# EAGLE design Base_Board (EAGLE 9.4.2)

## Sheet 1 of 3
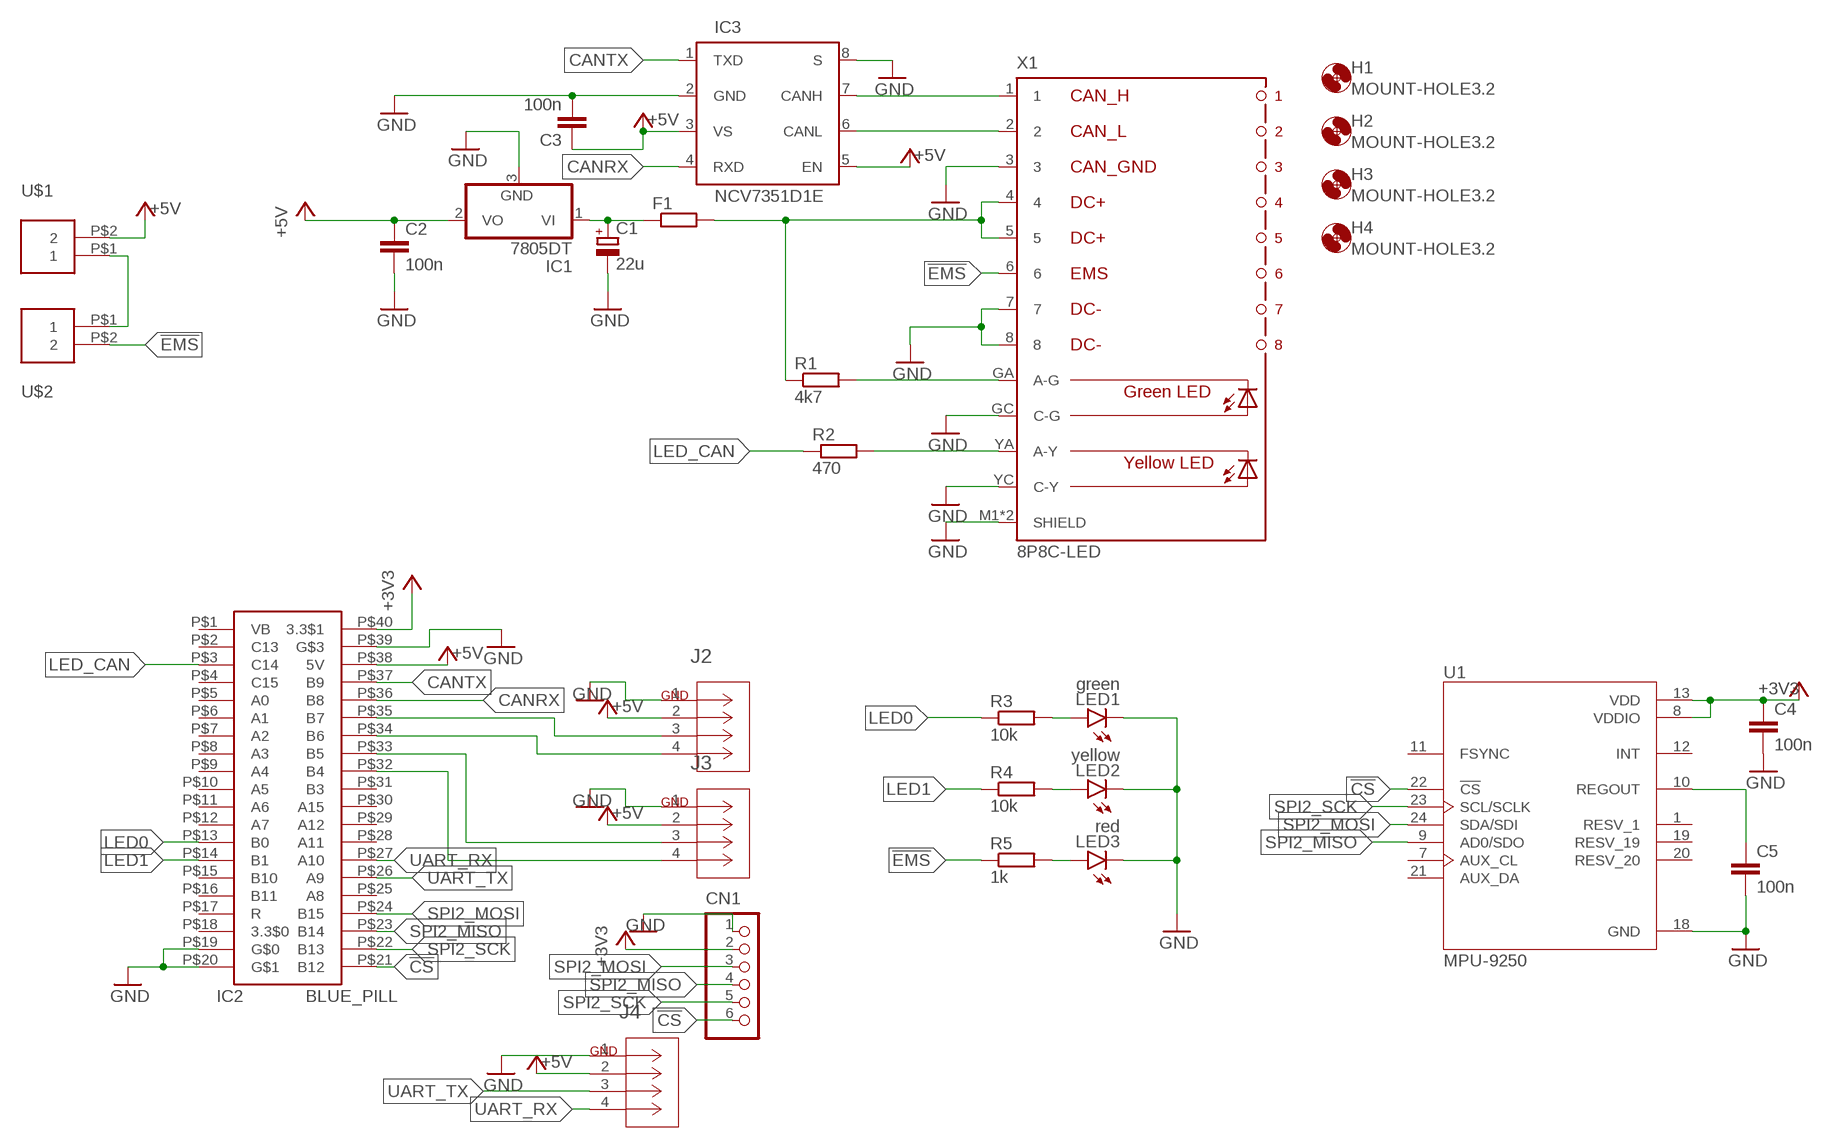
[diagram p0: schematic, sheet 1]

### Parts
C1  22u  CPOL-EUE2.5-5  [E2,5-5]
C2  100n  C-EUC0603  [C0603]
C3  100n  C-EUC0603  [C0603]
C4  100n  C-EUC0603  [C0603]
C5  100n  C-EUC0603  [C0603]
CN1  S6B-XH-A  [S6B-XH-A]
F1  R-EU_R1206  [R1206]
H1  MOUNT-HOLE3.2  [3,2]
H2  MOUNT-HOLE3.2  [3,2]
H3  MOUNT-HOLE3.2  [3,2]
H4  MOUNT-HOLE3.2  [3,2]
IC1  7805DT  [TO252]
IC2  BLUE_PILL  [BLUE_PILL]
IC3  NCV7351D1E  [SO08]
J2  EP2.5-4-SIDE  [CONN4_1744426-4]
J3  EP2.5-4-SIDE  [CONN4_1744426-4]
J4  EP2.5-4-SIDE  [CONN4_1744426-4]
LED1  green  LEDCHIPLED_0805  [CHIPLED_0805]
LED2  yellow  LEDCHIPLED_0805  [CHIPLED_0805]
LED3  red  LEDCHIPLED_0805  [CHIPLED_0805]
R1  4k7  R-EU_R0603  [R0603]
R2  470  R-EU_R0603  [R0603]
R3  10k  R-EU_R0603  [R0603]
R4  10k  R-EU_R0603  [R0603]
R5  1k  R-EU_R0603  [R0603]
U1  MPU-9250  [QFN40P300X300X105-24N]
U$1  XH-2-STRAIGHT  [CON-XH-2-STRAIGHT]
U$2  XH-2-STRAIGHT  [CON-XH-2-STRAIGHT]
X1  8P8C-LED  [8P8C-LED]

### Nets
!CS: CN1.6 IC2.P$21(B12) U1.22(!CS)
!EMS: R5.1 U$2.P$2 X1.6
+3V3: C4.1 CN1.2 IC2.P$40(3.3$1) U1.8(VDDIO) U1.13(VDD)
+5V: C2.1 C3.1 IC1.2(VO) IC2.P$38(5V) IC3.3(VS) IC3.5(EN) J2.2 J3.2 J4.2 U$1.P$2
CANRX: IC2.P$36(B8) IC3.4(RXD)
CANTX: IC2.P$37(B9) IC3.1(TXD)
GND: C1.- C2.2 C3.2 C4.2 C5.2 CN1.1 IC1.3(GND) IC2.P$19(G$0) IC2.P$20(G$1) IC2.P$39(G$3) IC3.2(GND) IC3.8(S) J2.1 J3.1 J4.1 LED1.C LED2.C LED3.C U1.18(GND) X1.3 X1.7 X1.8 X1.GC(C-G) X1.M1(SHIELD) X1.M2(SHIELD) X1.YC(C-Y)
LED0: IC2.P$13(B0) R3.1
LED1: IC2.P$14(B1) R4.1
LED_CAN: IC2.P$3(C14) R2.1
N$1: R1.2 X1.GA(A-G)
N$2: F1.2 R1.1 X1.4 X1.5
N$3: C1.+ F1.1 IC1.1(VI)
N$4: IC3.7(CANH) X1.1
N$5: IC3.6(CANL) X1.2
N$6: IC2.P$32(B4) J3.4
N$7: IC2.P$33(B5) J3.3
N$8: IC2.P$34(B6) J2.4
N$9: R2.2 X1.YA(A-Y)
N$10: IC2.P$35(B7) J2.3
N$11: U$1.P$1 U$2.P$1
N$13: LED1.A R3.2
N$14: LED2.A R4.2
N$15: LED3.A R5.2
N$20: C5.1 U1.10(REGOUT)
SPI2_MISO: CN1.4 IC2.P$23(B14) U1.9(AD0/SDO)
SPI2_MOSI: CN1.3 IC2.P$24(B15) U1.24(SDA/SDI)
SPI2_SCK: CN1.5 IC2.P$22(B13) U1.23(SCL/SCLK)
UART_RX: IC2.P$27(A10) J4.4
UART_TX: IC2.P$26(A9) J4.3
Unconnected: IC2.P$1(VB) IC2.P$2(C13) IC2.P$4(C15) IC2.P$5(A0) IC2.P$6(A1) IC2.P$7(A2) IC2.P$8(A3) IC2.P$9(A4) IC2.P$10(A5) IC2.P$11(A6) IC2.P$12(A7) IC2.P$15(B10) IC2.P$16(B11) IC2.P$17(R) IC2.P$18(3.3$0) IC2.P$25(A8) IC2.P$28(A11) IC2.P$29(A12) IC2.P$30(A15) IC2.P$31(B3) U1.1(RESV_1) U1.7(AUX_CL) U1.11(FSYNC) U1.12(INT) U1.19(RESV_19) U1.20(RESV_20) U1.21(AUX_DA)

## Sheet 2 of 3

## Sheet 3 of 3

## Library data of the parts
C1 = rcl:CPOL-EU: POLARIZED CAPACITOR, European symbol; SPICEPREFIX: C
C2-C5 = rcl:C-EU: CAPACITOR, European symbol; SPICEPREFIX: C
CN1 = jst-xh:S6B-XH-A: Wire-to-Board 2.5mm pitch side mount connector Source: http://www.jst-mfg.com/product/pdf/jpn/XH.pdf http://www.jst-mfg.com/product/detail.php?series=277
F1 R1-R5 = rcl:R-EU_: RESISTOR, European symbol; SPICEPREFIX: R
H1-H4 = holes:MOUNT-HOLE: MOUNTING HOLE with drill center marker
IC1 = linear:78*: Positive VOLTAGE REGULATOR Source: http://cache.national.com/ds/LM/LM78L05.pdf http://www.fairchildsemi.com/ds/LM/LM7805.pdf
IC2 = stm32_mcu:BLUE_PILL
IC3 = on-semi:NCV7351D1E: High Speed CAN Transceiver Source: NCV7351-D.PDF <http://www.onsemi.com/PowerSolutions/document/NCV7351-D.PDF>
J2-J4 = con-ep2.5:EP2.5-4-SIDE; MANUFACTURER_PART_NUMBER: 17444264; VENDOR: TE Connectivity
LED1-LED3 = led:LED: LED OSRAM: - CHIPLED LG R971, LG N971, LY N971, LG Q971, LY Q971, LO R971, LY R971 LH N974, LH R974 LS Q976, LO Q976, LY Q976 LO Q996 - Hyper CHIPLED LW Q18S LB Q993, LB Q99A, LB R99A - SideLED LS A670, LO A670, LY A670, LG A670, LP A670 LB A673, LV A673, LT A673, LW A673 LH A674 LY A675 LS A676, LA A676, LO A676, LY A676, LW A676 LS A679, LY A679, LG A679 - Hyper Micro SIDELED® LS Y876, LA Y876, LO Y876, LY Y876 LT Y87S - SmartLED LW L88C, LW L88S LB L89C, LB L89S, LG L890 LS L89K, LO L89K, LY L89K LS L896, LA L896, LO L896, LY L896 - TOPLED LS T670, LO T670, LY T670, LG T670, LP T670 LSG T670, LSP T670, LSY T670, LOP T670, LYG T670 LG T671, LOG T671, LSG T671 LB T673, LV T673, LT T673, LW T673 LH T674 LS T676, LA T676, LO T676, LY T676, LB T676, LH T676, LSB T676, LW T676 LB T67C, LV T67C, LT T67C, LS T67K, LO T67K, LY T67K, LW E67C LS E67B, LA E67B, LO E67B, LY E67B, LB E67C, LV E67C, LT E67C LW T67C LS T679, LY T679, LG T679 LS T770, LO T770, LY T770, LG T770, LP T770 LB T773, LV T773, LT T773, LW T773 LH T774 LS E675, LA E675, LY E675, LS T675 LS T776, LA T776, LO T776, LY T776, LB T776 LHGB T686 LT T68C, LB T68C - Hyper Mini TOPLED® LB M676 - Mini TOPLED Santana® LG M470 LS M47K, LO M47K, LY M47K Source: http://www.osram.convergy.de LUXEON: - LUMILED® LXK2-PW12-R00, LXK2-PW12-S00, LXK2-PW14-U00, LXK2-PW14-V00 LXK2-PM12-R00, LXK2-PM12-S00, LXK2-PM14-U00 LXK2-PE12-Q00, LXK2-PE12-R00, LXK2-PE12-S00, LXK2-PE14-T00, LXK2-PE14-U00 LXK2-PB12-K00, LXK2-PB12-L00, LXK2-PB12-M00, LXK2-PB14-N00, LXK2-PB14-P00, LXK2-PB14-Q00 LXK2-PR12-L00, LXK2-PR12-M00, LXK2-PR14-Q00, LXK2-PR14-R00 LXK2-PD12-Q00, LXK2-PD12-R00, LXK2-PD12-S00 LXK2-PH12-R00, LXK2-PH12-S00 LXK2-PL12-P00, LXK2-PL12-Q00, LXK2-PL12-R00 Source: www.luxeon.com KINGBRIGHT: KA-3528ASYC Source: www.kingbright.com
U1 = MPU-9250:MPU-9250: Axis=3 Axis Gyro+3 Axis Accel+Compass. Pin For Pin With m; AVAILABILITY: Unavailable; DESCRIPTION: SMD Gyroscope/Accelerometer/Magnetometer Sensor; 9-AXIS; MF: TDK InvenSense; MP: MPU-9250; PACKAGE: QFN-24 TDK InvenSense; PRICE: None
U$1 U$2 = con-xh:XH-2-STRAIGHT
X1 = con-rj45:8P8C-LED: generic 8P8C connector with two LED's; OC_FARNELL: unknown; OC_NEWARK: unknown

## Board
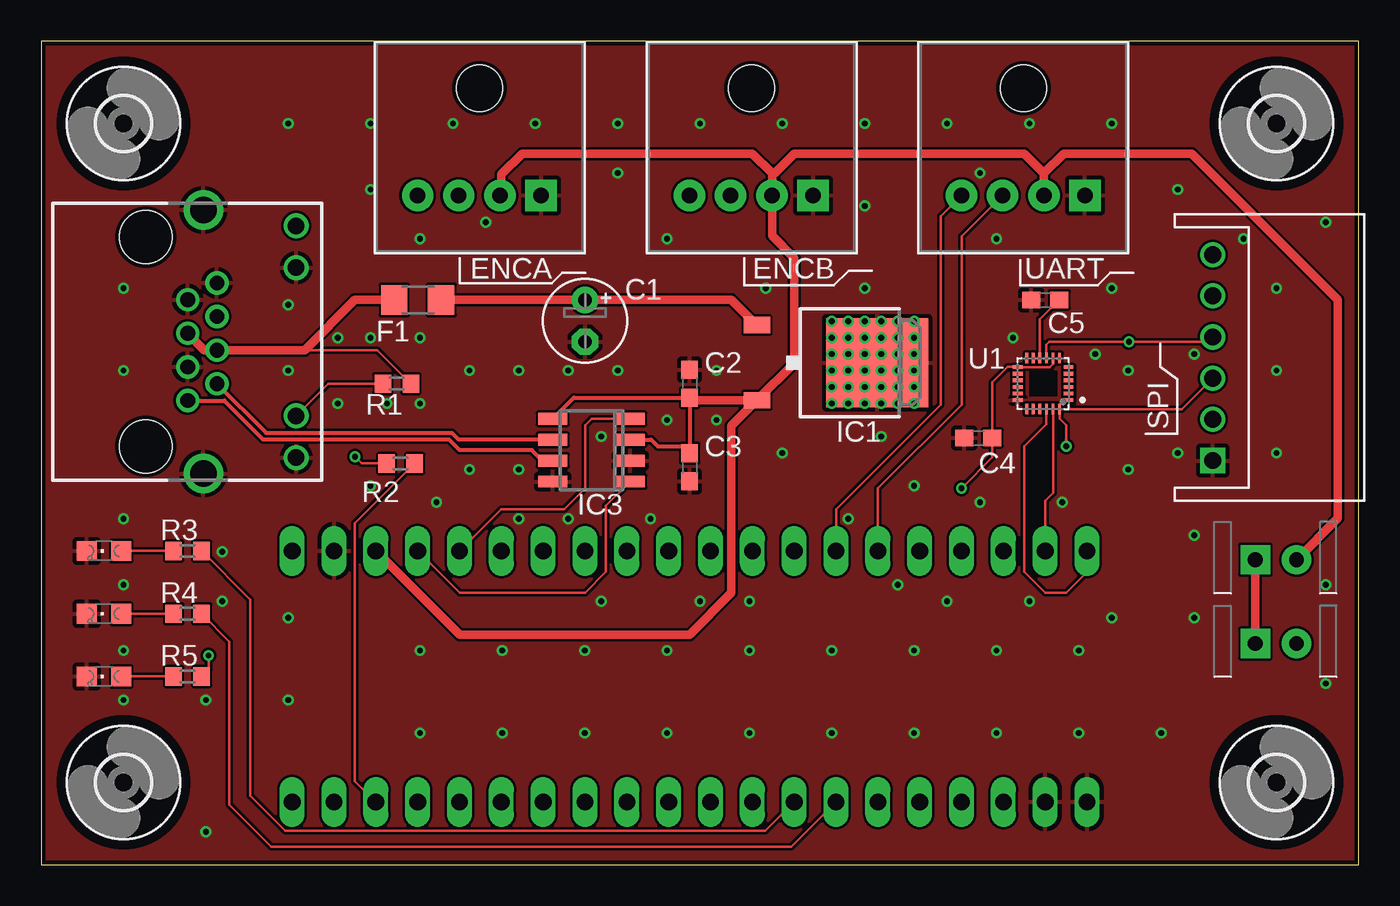
[diagram p1: board, top side]
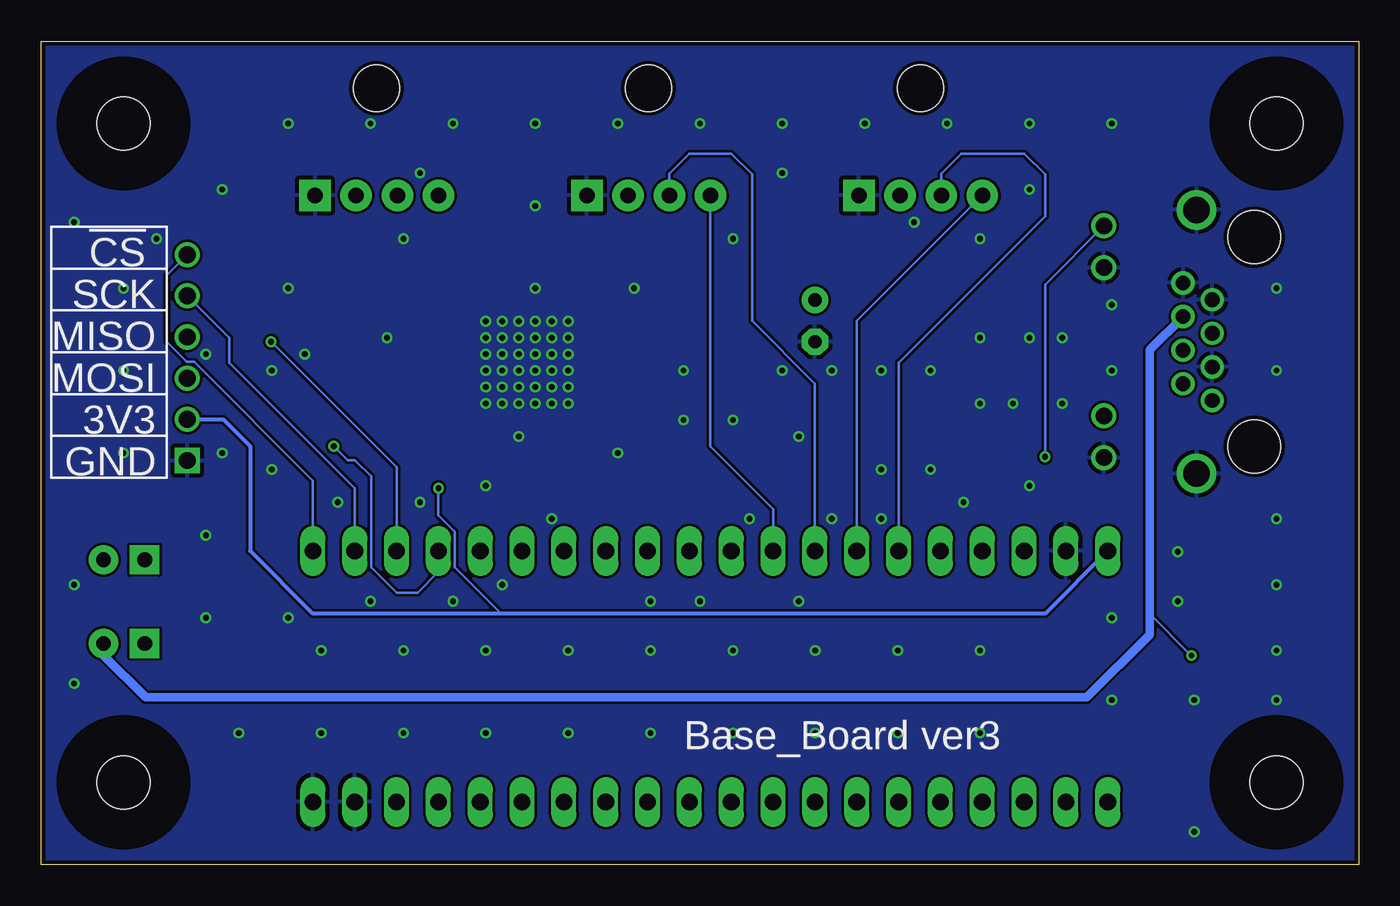
[diagram p2: board, bottom side, seen from below]

Size 80 x 50 mm. Coordinates in mm from the lower left corner, seen from the top.
Outline: 0,0 80,0 80,50 0,50 0,0
Copper layers (1*16): Top 0.035mm / dielectric 1.5mm / Bottom 0.035mm
Design rules "SeeedStudio_2layer_DRU_no_angle_20140221 *": minimum track width 6mil, minimum drill 12mil, track to track 6mil, track to pad 6mil, pad to pad 6mil, via to via 6mil, smd to smd 0mil, copper to edge 10mil, drill to drill 10mil, minimum pad ring 10mil, minimum via ring 6mil, stop-mask expansion 2mil, vias tented up to drill 100mil, thermal gap 10mil

### Footprints (pad centres in the part's own frame; a part is rotated, then mirrored left to right if it is on the bottom)
E2,5-5 = drill 0.813 pad 1.6: + -1.27,0 | drill 0.813 pad 1.6 octagon: - 1.27,0
C0603 = smd 1.1 x 1: 1 -0.85,0; 2 0.85,0
S6B-XH-A = drill 1.016 square: 1 6.25,0 | drill 1.016: 2 3.75,0; 3 1.25,0; 4 -1.25,0; 5 -3.75,0; 6 -6.25,0
R1206 = smd 1.6 x 1.803: 1 -1.422,0; 2 1.422,0
3,2 = hole 3.2: 0,0
TO252 = smd 1 x 1.6: 1 -2.28,-4.8; 2 2.28,-4.8 | smd 5.4 x 6.2: 3 0,2.5
BLUE_PILL = drill 1.016 long: P$1 -7.62,10.16; P$2 -7.62,7.62; P$3 -7.62,5.08; P$4 -7.62,2.54; P$5 -7.62,0; P$6 -7.62,-2.54; P$7 -7.62,-5.08; P$8 -7.62,-7.62; P$9 -7.62,-10.16; P$10 -7.62,-12.7; P$11 -7.62,-15.24; P$12 -7.62,-17.78; P$13 -7.62,-20.32; P$14 -7.62,-22.86; P$15 -7.62,-25.4; P$16 -7.62,-27.94; P$17 -7.62,-30.48; P$18 -7.62,-33.02; P$19 -7.62,-35.56; P$20 -7.62,-38.1; P$21 7.62,-38.1; P$22 7.62,-35.56; P$23 7.62,-33.02; P$24 7.62,-30.48; P$25 7.62,-27.94; P$26 7.62,-25.4; P$27 7.62,-22.86; P$28 7.62,-20.32; P$29 7.62,-17.78; P$30 7.62,-15.24; P$31 7.62,-12.7; P$32 7.62,-10.16; P$33 7.62,-7.62; P$34 7.62,-5.08; P$35 7.62,-2.54; P$36 7.62,0; P$37 7.62,2.54; P$38 7.62,5.08; P$39 7.62,7.62; P$40 7.62,10.16
SO08 = smd 0.72 x 1.78: 1 -1.905,-2.35; 2 -0.635,-2.35; 3 0.635,-2.35; 4 1.905,-2.35; 5 1.905,2.35; 6 0.635,2.35; 7 -0.635,2.35; 8 -1.905,2.35
CONN4_1744426-4 = drill 0.94 pad 1.905 square: 1 7.493,0 | drill 0.94 pad 1.905: 2 5.004,0; 3 2.489,0; 4 0,0 | hole 2.794: 3.759,6.502
CHIPLED_0805 = smd 1.2 x 1.2: A 0,-1.05; C 0,1.05
R0603 = smd 1 x 1.1: 1 -0.85,0; 2 0.85,0
QFN40P300X300X105-24N = smd 0.64 x 0.22: 1 -1.545,1; 2 -1.545,0.6; 3 -1.545,0.2; 4 -1.545,-0.2; 5 -1.545,-0.6; 6 -1.545,-1; 13 1.545,-1; 14 1.545,-0.6; 15 1.545,-0.2; 16 1.545,0.2; 17 1.545,0.6; 18 1.545,1 | smd 0.22 x 0.64: 7 -1,-1.545; 8 -0.6,-1.545; 9 -0.2,-1.545; 10 0.2,-1.545; 11 0.6,-1.545; 12 1,-1.545; 19 1,1.545; 20 0.6,1.545; 21 0.2,1.545; 22 -0.2,1.545; 23 -0.6,1.545; 24 -1,1.545
CON-XH-2-STRAIGHT = drill 0.9 pad 1.778 square: P$1 1.21,-0.73 | drill 0.9 pad 1.778: P$2 -1.29,-0.73
8P8C-LED = drill 0.9 pad 1.3: 1 3.57,-3.81; 2 2.55,-2.03; 3 1.53,-3.81; 4 0.51,-2.03; 5 -0.51,-3.81; 6 -1.53,-2.03; 7 -2.55,-3.81; 8 -3.57,-2.03 | drill 1 pad 1.422: GA 4.5,2.78; GC 7.04,2.78; YA -7.04,2.78; YC -4.5,2.78 | drill 1.6 pad 2.184: M1 -8,-2.85; M2 8,-2.85 | hole 3.2: 6.35,-6.35; -6.35,-6.35

### Placement (x,y rotation side)
C1  33.02,33.02 270 top
C2  39.37,29.21 90 top
C3  39.37,24.13 270 top
C4  56.9,25.91 180 top
C5  60.96,34.29 180 top
CN1  71.13,30.79 270 top
F1  22.86,34.29 180 top
H1  5,5 0 top
H2  5,45 0 top
H3  75,45 0 top
H4  75,5 0 top
IC1  48.26,30.48 270 top
IC2  25.4,11.43 90 top
IC3  33.41,25.17 90 top
J2  22.86,40.64 0 top
J3  39.37,40.64 0 top
J4  55.88,40.64 0 top
LED1  3.81,19.05 90 top
LED2  3.81,15.24 90 top
LED3  3.81,11.43 90 top
R1  21.59,29.21 180 top
R2  21.82,24.36 180 top
R3  8.89,19.05 180 top
R4  8.89,15.24 180 top
R5  8.89,11.43 180 top
U1  60.83,29.21 180 top
U$1  74.93,17.78 180 top
U$2  74.93,12.7 180 top
X1  12.7,31.75 270 top

### Tracks (layer width: path | path; a pad name or v marks a point on that pad's centre or on a via)
!CS
  Top 0.152: IC2.P$21 63.5,17.78 62.23,16.51 60.96,16.51 59.69,17.78 59.69,25.4 61.03,26.74 U1.22
  Bottom 0.152: CN1.6 72.39,35.78 72.39,31.75 71.17,30.53 70.72,30.53 63.5,23.31 IC2.P$21
!EMS  (via drill 0.35)
  Top 0.152: v10.16,12.7 10.16,11.85 R5.1
  Bottom 0.152: v10.16,12.7 12.7,15.24
  Bottom 0.508: X1.6 12.7,31.25 12.7,15.24 12.7,13.97 16.51,10.16 73.66,10.16 76.22,12.72 U$2.P$2
+3V3  (via drill 0.35)
  Top 0.152: U1.8 61.43,30.42 61.22,30.21 59.64,30.21 U1.13 59.27,30.23 58.67,30.23 57.75,29.3 C4.1 57.75,24.73 v55.88,22.86
  Bottom 0.152: 52.07,15.24 54.89,18.06 54.89,20.22 55.88,21.21 v55.88,22.86
  Bottom 0.254: IC2.P$40 19.05,15.24 52.07,15.24 63.5,15.24 67.31,19.05 67.31,25.4 68.95,27.04 CN1.2
+5V
  Top 0.254: IC3.5 32.34,28.36 C2.1 C3.1 38.95,25.4 37.44,25.4 37.03,25.8 IC3.3
  Top 0.508: IC1.2 39.53,28.2 C2.1 | IC1.2 45.72,30.46 45.72,36.83 44.37,38.18 J3.2 44.37,41.99 | J2.2 27.94,40.72 27.94,41.91 29.21,43.18 43.18,43.18 44.37,41.99 | J4.2 60.88,41.99 | 60.88,41.99 59.69,43.18 45.72,43.18 44.53,41.99 44.37,41.99 | 60.88,41.99 62.08,43.18 69.85,43.18 78.73,34.3 78.73,21.02 U$1.P$2 | IC2.P$38 25.4,13.97 39.37,13.97 41.91,16.51 41.91,26.65 IC1.2
CANRX
  Top 0.152: IC2.P$36 27.94,21.59 31.75,21.59 33.02,22.86 33.02,26.67 33.42,27.07 IC3.4
CANTX
  Top 0.152: IC2.P$37 25.4,16.51 33.02,16.51 34.29,17.78 34.29,21.8 IC3.1
GND  (via drill 0.35)
  other vias: 15,10 10,10 5,10 15,15 15,30 5,30 5,35 65,15 70,15 70,20 65,35 50,35 50,40 50,45 55,45 60,45 65,45 45,45 40,45 35,45 30,45 25,45 20,45 15,45 45,25 63,13 58,13 53,13 48,13 43,13 38,13 33,13 28,13 23,13 60,16 55,16 62,22 66,24 57,22 53,23 49,21 43,16 40,16 41,30 35,30 32,30 29,30 29,24 23,38 18,28 21,28 18,32 20,32 20,23 29,21 32,21 34,16 37,21 38,27 41,27 11,16 11,19 20,41 27,39 38,38 44,35 58,38 59,32 66,30 64,31 69,25 78,39 10,2 15,34 23,32 23,28 26,30 24,22 26,24 51,26 52,17 70,31 73,38 69,41 57,42 35,42 34,26 23,8 28,8 33,8 38,8 43,8 48,8 53,8 58,8 63,8 75,25 75,30 75,35 78,17 78,11 68,8 5,13 5,17 5,21 48,33 49,33 50,33 51,33 52,33 53,33 48,32 48,31 48,30 48,29 48,28 49,28 49,29 49,30 49,31 49,32 50,32 50,31 50,30 50,29 50,28 51,28 51,29 51,30 51,31 51,32 52,32 52,31 52,30 52,29 52,28 53,28 53,29 53,30 53,31 53,32
  pour Top: 0,50 0,0 80,0 80,50
  pour Bottom: 0,50 0,0 80,0 80,50
LED0
  Top 0.152: IC2.P$13 43.97,2.06 15.24,2.06 14.83,2.06 12.7,4.19 12.7,16.09 R3.1
LED1
  Top 0.152: IC2.P$14 45.54,1.09 13.97,1.09 11.43,3.63 11.43,13.55 R4.1
LED_CAN
  Top 0.152: R2.1 19.05,20.74 19.05,5.08 IC2.P$3
N$1
  Top 0.152: R1.2 17.44,29.21 X1.GA
N$2
  Top 0.152: R1.1 20.41,31.24 16,31.24
  Top 0.508: X1.5 9.91,31.24 X1.4 16,31.24 19.05,34.29 F1.2
N$3
  Top 0.508: F1.1 C1.+ 41.91,34.29 43.44,32.76 IC1.1
N$4
  Top 0.254: X1.1 11.12,28.18 13.48,25.81 24.77,25.81 25.41,25.17 29.79,25.17 30.43,24.54 IC3.7
N$5
  Top 0.254: X1.2 13.65,26.22 24.93,26.22 25.34,25.8 IC3.6
N$6
  Bottom 0.152: J3.4 39.37,25.4 35.56,21.59 IC2.P$32
N$7
  Bottom 0.152: IC2.P$33 33.02,29.21 36.83,33.02 36.83,41.91 38.1,43.18 40.64,43.18 41.86,41.96 J3.3
N$8
  Bottom 0.152: J2.4 30.48,33.02 IC2.P$34
N$9  (via drill 0.35)
  Top 0.152: R2.2 19.45,24.36 v19.05,24.77
  Bottom 0.152: X1.YA 19.05,35.22 v19.05,24.77
N$10
  Bottom 0.152: IC2.P$35 27.94,30.48 19.05,39.37 19.05,41.91 20.32,43.18 24.13,43.18 25.35,41.96 J2.3
N$11
  Top 0.508: U$1.P$1 U$2.P$1
N$13
  Top 0.152: LED1.A R3.2
N$14
  Top 0.152: LED2.A R4.2
N$15
  Top 0.152: LED3.A R5.2
N$20
  Top 0.152: U1.10 60.63,33.11 C5.1
SPI2_MISO  (via drill 0.35)
  Top 0.152: CN1.4 70.84,31.75 v66.04,31.75 61.21,31.75 61.03,31.57 U1.9
  Bottom 0.152: IC2.P$23 58.42,24.13 v66.04,31.75
SPI2_MOSI  (via drill 0.35)
  Top 0.152: CN1.3 69.25,27.66 U1.24 61.83,27.07 62.23,26.67 v62.23,25.4
  Bottom 0.152: v62.23,25.4 61.39,24.56 60.96,24.56 59.97,23.57 59.97,18.06 58.42,16.51 57.15,16.51 55.88,17.78 IC2.P$24
SPI2_SCK
  Top 0.152: U1.23 61.43,22.57 60.96,22.1 IC2.P$22
  Bottom 0.152: IC2.P$22 60.96,22.86 68.58,30.48 68.58,31.99 CN1.5
UART_RX
  Top 0.152: J4.4 54.61,39.37 54.61,27.94 48.26,21.59 IC2.P$27
UART_TX
  Top 0.152: IC2.P$26 50.8,22.86 55.88,27.94 55.88,38.15 J4.3

### Text on the board
tNames: ENCA | ENCB | UART | SPI
bNames: !CS | SCK | MISO | MOSI | 3V3 | GND | Base_Board ver3